# Altium schematic sheet MainBoard.SchDoc
size A3
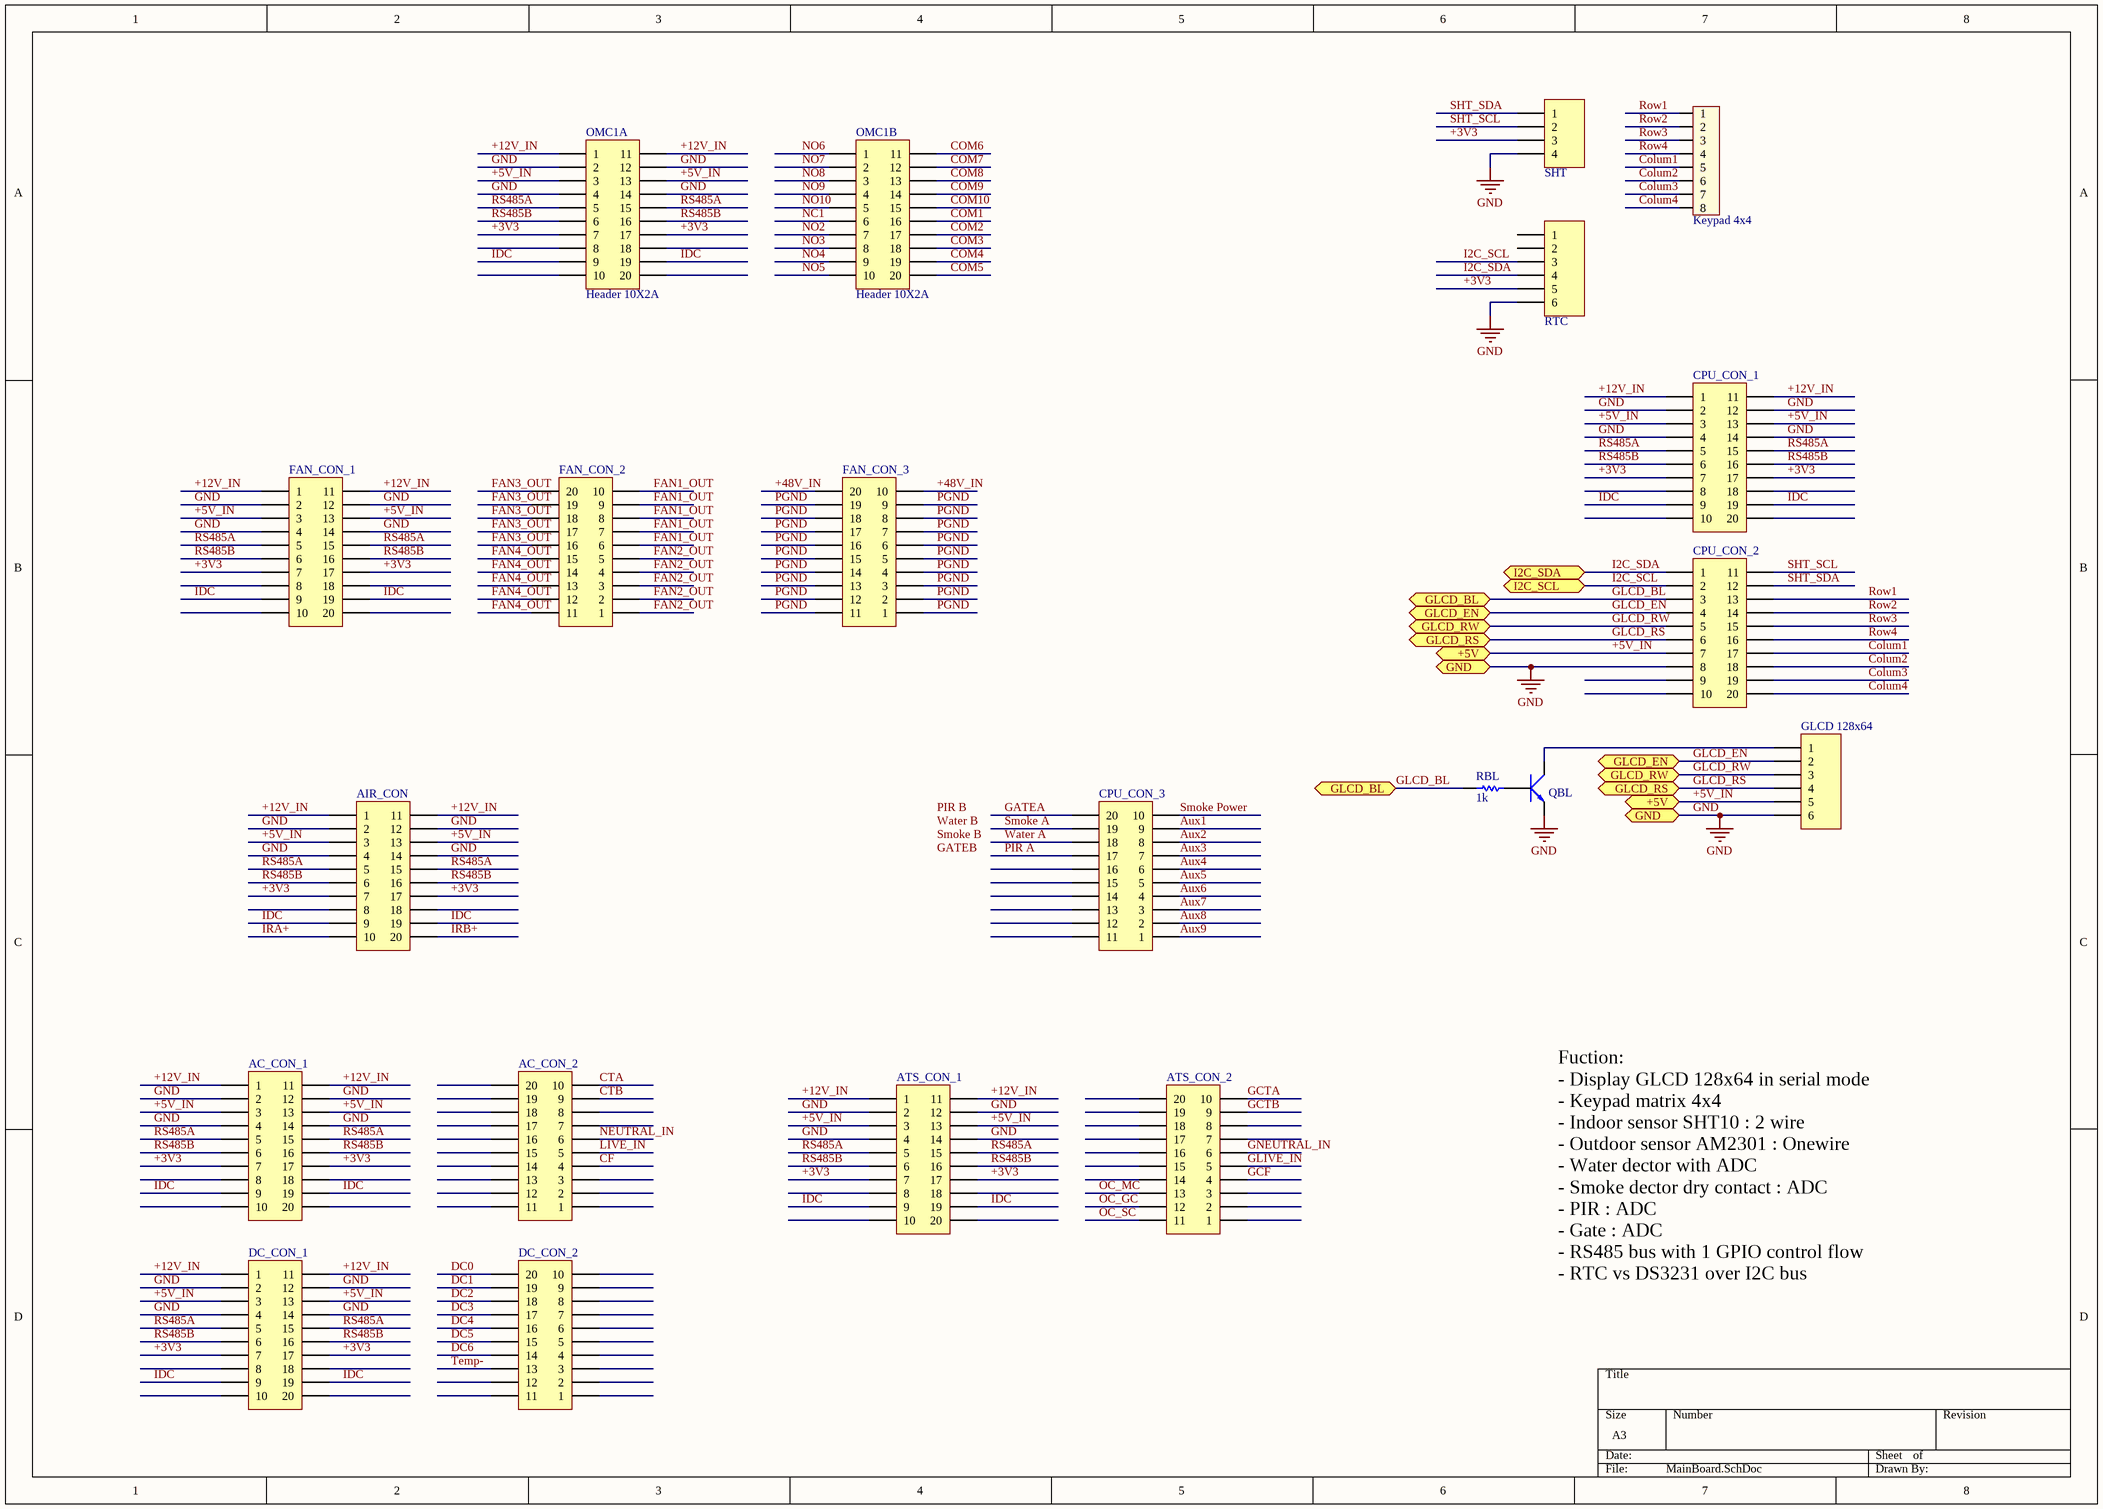
[diagram p0: MainBoard.SchDoc]

## Parts
AC_CON_1  Header 10X2A  [HDR2X10_CEN]  (value not drawn)
AC_CON_2  Header 10X2A  [HDR2X10_CEN]  (value not drawn)
AIR_CON  Header 10X2A  [HDR2X10_CEN]  (value not drawn)
ATS_CON_1  Header 10X2A  [HDR2X10_CEN]  (value not drawn)
ATS_CON_2  Header 10X2A  [HDR2X10_CEN]  (value not drawn)
CPU_CON_1  Header 10X2A  [HDR2X10_CEN]  (value not drawn)
CPU_CON_2  Header 10X2A  [HDR2X10_CEN]  (value not drawn)
CPU_CON_3  Header 10X2A  [HDR2X10_CEN]  (value not drawn)
DC_CON_1  Header 10X2A  [HDR2X10_CEN]  (value not drawn)
DC_CON_2  Header 10X2A  [HDR2X10_CEN]  (value not drawn)
FAN_CON_1  Header 10X2A  [HDR2X10_CEN]  (value not drawn)
FAN_CON_2  Header 10X2A  [HDR2X10_CEN]  (value not drawn)
FAN_CON_3  Header 10X2A  [HDR2X10_CEN]  (value not drawn)
GLCD_128x64  Header 6  [HDR1X6]  (value not drawn)
Keypad_4x4  JP8  [CON8]  (value not drawn)
OMC1A  Header 10X2A  [HDR2X10_CEN]
OMC1B  Header 10X2A  [HDR2X10_CEN]
QBL  C828  [SOT23 TOP]  (value not drawn)
RBL  value 1k  [RESC1608N_ZERO]  (hidden comment: Res)
RTC  Header 6  [HDR1X6]  (value not drawn)
SHT  Header 4  [HDR1X4]  (value not drawn)

## Ports
+5V, GLCD_BL, GLCD_EN, GLCD_RS, GLCD_RW, GND, I2C_SCL, I2C_SDA

## Nets
GND: AC_CON_1.2 AC_CON_1.4 AC_CON_1.12 AC_CON_1.14 AIR_CON.2 AIR_CON.4 AIR_CON.12 AIR_CON.14 ATS_CON_1.2 ATS_CON_1.4 ATS_CON_1.12 ATS_CON_1.14 CPU_CON_1.2 CPU_CON_1.4 CPU_CON_1.12 CPU_CON_1.14 CPU_CON_2.8 DC_CON_1.2 DC_CON_1.4 DC_CON_1.12 DC_CON_1.14 FAN_CON_1.2 FAN_CON_1.4 FAN_CON_1.12 FAN_CON_1.14 GLCD_128x64.6 OMC1A.2 OMC1A.4 OMC1A.12 OMC1A.14 QBL.3(E) RTC.6 SHT.4 ; port GND
+3V3: AC_CON_1.7 AC_CON_1.17 AIR_CON.7 AIR_CON.17 ATS_CON_1.7 ATS_CON_1.17 CPU_CON_1.7 CPU_CON_1.17 DC_CON_1.7 DC_CON_1.17 FAN_CON_1.7 FAN_CON_1.17 OMC1A.7 OMC1A.17 RTC.5 SHT.3
+5V_IN: AC_CON_1.3 AC_CON_1.13 AIR_CON.3 AIR_CON.13 ATS_CON_1.3 ATS_CON_1.13 CPU_CON_1.3 CPU_CON_1.13 CPU_CON_2.7 DC_CON_1.3 DC_CON_1.13 FAN_CON_1.3 FAN_CON_1.13 GLCD_128x64.5 OMC1A.3 OMC1A.13 ; port +5V
+12V_IN: AC_CON_1.1 AC_CON_1.11 AIR_CON.1 AIR_CON.11 ATS_CON_1.1 ATS_CON_1.11 CPU_CON_1.1 CPU_CON_1.11 DC_CON_1.1 DC_CON_1.11 FAN_CON_1.1 FAN_CON_1.11 OMC1A.1 OMC1A.11
+48V_IN: FAN_CON_3.10 FAN_CON_3.20
Aux1: CPU_CON_3.9
Aux2: CPU_CON_3.8
Aux3: CPU_CON_3.7
Aux4: CPU_CON_3.6
Aux5: CPU_CON_3.5
Aux6: CPU_CON_3.4
Aux7: CPU_CON_3.3
Aux8: CPU_CON_3.2
Aux9: CPU_CON_3.1
CF: AC_CON_2.4
Colum1: CPU_CON_2.17 Keypad_4x4.5
Colum2: CPU_CON_2.18 Keypad_4x4.6
Colum3: CPU_CON_2.19 Keypad_4x4.7
Colum4: CPU_CON_2.20 Keypad_4x4.8
COM1: OMC1B.16
COM2: OMC1B.17
COM3: OMC1B.18
COM4: OMC1B.19
COM5: OMC1B.20
COM6: OMC1B.11
COM7: OMC1B.12
COM8: OMC1B.13
COM9: OMC1B.14
COM10: OMC1B.15
CTA: AC_CON_2.10
CTB: AC_CON_2.9
DC0: DC_CON_2.20
DC1: DC_CON_2.19
DC2: DC_CON_2.18
DC3: DC_CON_2.17
DC4: DC_CON_2.16
DC5: DC_CON_2.15
DC6: DC_CON_2.14
FAN1_OUT: FAN_CON_2.6 FAN_CON_2.7 FAN_CON_2.8 FAN_CON_2.9 FAN_CON_2.10
FAN2_OUT: FAN_CON_2.1 FAN_CON_2.2 FAN_CON_2.3 FAN_CON_2.4 FAN_CON_2.5
FAN3_OUT: FAN_CON_2.16 FAN_CON_2.17 FAN_CON_2.18 FAN_CON_2.19 FAN_CON_2.20
FAN4_OUT: FAN_CON_2.11 FAN_CON_2.12 FAN_CON_2.13 FAN_CON_2.14 FAN_CON_2.15
GATEA: CPU_CON_3.20
GCF: ATS_CON_2.4
GCTA: ATS_CON_2.10
GCTB: ATS_CON_2.9
GLCD_BL: CPU_CON_2.3 RBL.1 ; port GLCD_BL
GLCD_EN: CPU_CON_2.4 GLCD_128x64.2 ; port GLCD_EN
GLCD_RS: CPU_CON_2.6 GLCD_128x64.4 ; port GLCD_RS
GLCD_RW: CPU_CON_2.5 GLCD_128x64.3 ; port GLCD_RW
GLIVE_IN: ATS_CON_2.5
GNEUTRAL_IN: ATS_CON_2.6
I2C_SCL: CPU_CON_2.2 RTC.3 ; port I2C_SCL
I2C_SDA: CPU_CON_2.1 RTC.4 ; port I2C_SDA
IDC: AC_CON_1.9 AC_CON_1.19 AIR_CON.9 AIR_CON.19 ATS_CON_1.9 ATS_CON_1.19 CPU_CON_1.9 CPU_CON_1.19 DC_CON_1.9 DC_CON_1.19 FAN_CON_1.9 FAN_CON_1.19 OMC1A.9 OMC1A.19
IRA+: AIR_CON.10
IRB+: AIR_CON.20
LIVE_IN: AC_CON_2.5
NC1: OMC1B.6
NEUTRAL_IN: AC_CON_2.6
NO2: OMC1B.7
NO3: OMC1B.8
NO4: OMC1B.9
NO5: OMC1B.10
NO6: OMC1B.1
NO7: OMC1B.2
NO8: OMC1B.3
NO9: OMC1B.4
NO10: OMC1B.5
OC_GC: ATS_CON_2.12
OC_MC: ATS_CON_2.13
OC_SC: ATS_CON_2.11
PGND: FAN_CON_3.1 FAN_CON_3.2 FAN_CON_3.3 FAN_CON_3.4 FAN_CON_3.5 FAN_CON_3.6 FAN_CON_3.7 FAN_CON_3.8 FAN_CON_3.9 FAN_CON_3.11 FAN_CON_3.12 FAN_CON_3.13 FAN_CON_3.14 FAN_CON_3.15 FAN_CON_3.16 FAN_CON_3.17 FAN_CON_3.18 FAN_CON_3.19
PIR A: CPU_CON_3.17
Row1: CPU_CON_2.13 Keypad_4x4.1
Row2: CPU_CON_2.14 Keypad_4x4.2
Row3: CPU_CON_2.15 Keypad_4x4.3
Row4: CPU_CON_2.16 Keypad_4x4.4
RS485A: AC_CON_1.5 AC_CON_1.15 AIR_CON.5 AIR_CON.15 ATS_CON_1.5 ATS_CON_1.15 CPU_CON_1.5 CPU_CON_1.15 DC_CON_1.5 DC_CON_1.15 FAN_CON_1.5 FAN_CON_1.15 OMC1A.5 OMC1A.15
RS485B: AC_CON_1.6 AC_CON_1.16 AIR_CON.6 AIR_CON.16 ATS_CON_1.6 ATS_CON_1.16 CPU_CON_1.6 CPU_CON_1.16 DC_CON_1.6 DC_CON_1.16 FAN_CON_1.6 FAN_CON_1.16 OMC1A.6 OMC1A.16
SHT_SCL: CPU_CON_2.11 SHT.2
SHT_SDA: CPU_CON_2.12 SHT.1
Smoke A: CPU_CON_3.19
Smoke Power: CPU_CON_3.10
Temp-: DC_CON_2.13
Water A: CPU_CON_3.18
NetGLCD_128x64_1: GLCD_128x64.1 QBL.2(C)
NetQBL_1: QBL.1(B) RBL.2

Not connected (* = marked no-connect by the designer): AC_CON_1 8 10 18 20; AC_CON_2 1 2 3 7 8 11 12 13 14 15 16 17 18 19 20; AIR_CON 8 18; ATS_CON_1 8 10 18 20; ATS_CON_2 1 2 3 7 8 14 15 16 17 18 19 20; CPU_CON_1 8 10 18 20; CPU_CON_2 9 10; CPU_CON_3 11 12 13 14 15 16; DC_CON_1 8 10 18 20; DC_CON_2 1 2 3 4 5 6 7 8 9 10 11 12; FAN_CON_1 8 10 18 20; OMC1A 8 10 18 20; RTC 1 2

## Notes on the sheet
- Fuction:
  - Display GLCD 128x64 in serial mode
  - Keypad matrix 4x4
  - Indoor sensor SHT10 : 2 wire
  - Outdoor sensor AM2301 : Onewire
  - Water dector with ADC
  - Smoke dector dry contact : ADC
  - PIR : ADC
  - Gate : ADC
  - RS485 bus with 1 GPIO control flow
  - RTC vs DS3231 over I2C bus
- Labels drawn without touching a wire or pin: GATEB, PIR B, Smoke B, Water B

## Library data of the parts
AC_CON_1 AC_CON_2 AIR_CON ATS_CON_1 ATS_CON_2 CPU_CON_1-CPU_CON_3 DC_CON_1 DC_CON_2 FAN_CON_1-FAN_CON_3 OMC1A OMC1B = Header 10X2A: Header, 10-Pin, Dual row; LatestRevisionDate: 17-Jul-2002; LatestRevisionNote: Re-released for DXP Platform.; Publisher: Altium Limited
GLCD_128x64 RTC = Header 6: Header, 6-Pin; LatestRevisionDate: 17-Jul-2002; LatestRevisionNote: Re-released for DXP Platform.; Publisher: Altium Limited
Keypad_4x4 = Con8: Connector 8; Value: Connector 8
QBL = NPN: Transistor C828 C1815....
SHT = Header 4: Header, 4-Pin; LatestRevisionDate: 17-Jul-2002; LatestRevisionNote: Re-released for DXP Platform.; Publisher: Altium Limited